# Altium schematic sheet oysm_Keyboard_Power_supply.SchDoc: PCA20020 - Power Supply
size A4; Organization: Nordic Semiconductor; DocumentNumber: 8; SheetNumber: 8; SheetTotal: 9; CompanyName: Nordic Semiconductor; DocumentSize: A4
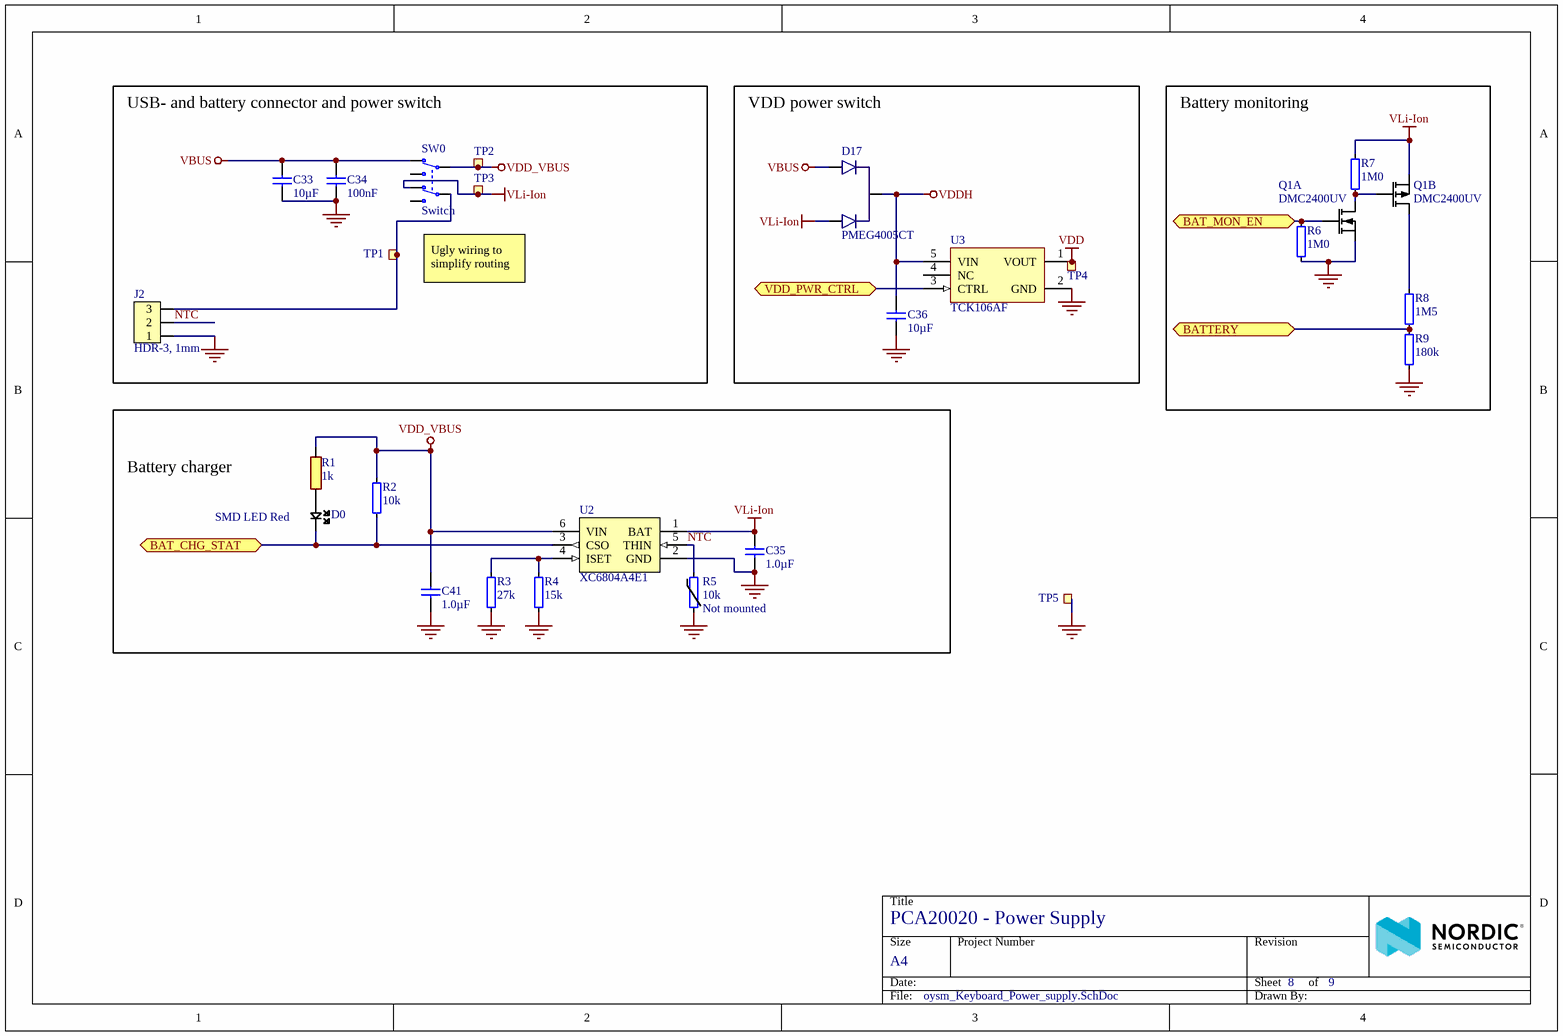
[diagram p0: oysm_Keyboard_Power_supply.SchDoc]

## Parts
C33  10µF  [CAPC1608X06L]
C34  100nF  [CAPC1005X04L]
C35  1.0µF  [CAPC1608X06L]
C36  10µF  [CAPC1608X06L]
C41  1.0µF  [CAPC1608X06L]
D0  SMD LED Red  [I_LEDC0603(1608)_N]
D17  PMEG4005CT  [SOT95P230X110-3N]
J2  HDR-3, 1mm  [SM03B-SRSS-TB]
Q1  DMC2400UV  [SOTFL50P162X60-6N]  (parts A,B of 2)
R1  1k  [RESC0603(1608)_N]
R2  10k  [RESC1005X04L]
R3  27k  [RESC1005X04L]
R4  15k  [RESC1005X04L]
R5  10k  Assembly: Not mounted  [RESC1005X04L]
R6  1M0  [RESC1005X04L]
R7  1M0  [RESC1005X04L]
R8  1M5  [RESC1005X04L]
R9  180k  [RESC1005X04L]
SW0  Switch  [Switch-Slide-RA-J-Lead-DPDT-8.5x3.5mm]
TP1  Ø1.5mm,SMD  [TP_SMD_Ø1.5mm]  (value not drawn)  (no BOM)
TP2  Ø1.5mm,SMD  [TP_SMD_Ø1.5mm]  (value not drawn)  (no BOM)
TP3  Ø1.5mm,SMD  [TP_SMD_Ø1.5mm]  (value not drawn)  (no BOM)
TP4  Ø1.5mm,SMD  [TP_SMD_Ø1.5mm]  (value not drawn)  (no BOM)
TP5  Ø1.5mm,SMD  [TP_SMD_Ø1.5mm]  (value not drawn)  (no BOM)
U2  XC6804A4E1  [USP-6EL]
U3  TCK106AF  [SOT95P280X140-5N]

## Blocks framed on the sheet
USB- and battery connector and power switch: C33 C34 J2 SW0 TP1-TP3
VDD power switch: C36 D17 TP4 U3
Battery monitoring: Q1 R6-R9
Battery charger: C35 C41 D0 R1-R5 U2

## Ports
BAT_CHG_STAT (bidir), BAT_MON_EN (bidir), BATTERY (bidir), VDD_PWR_CTRL (bidir)

## Nets
GND: C33.2 C34.2 C35.1 C36.1 C41.1 J2.1 Q1.1(S1) R3.2 R4.2 R5.2 R6.2 R9.2 TP5.1 U2.2(GND) U2.7(GND) U3.2(GND)
VBUS: C33.1 C34.1 D17.2(A) SW0.3(N.C-1)
VDD: TP4.1 U3.1(VOUT)
VDD_VBUS: C41.2 R1.2 R2.1 SW0.2(COM-1) TP2.1 U2.6(VIN)
VDDH: C36.2 D17.3(C) U3.5(VIN)
VLi-Ion: C35.2 D17.1(A) Q1.4(S2) R7.1 SW0.6(N.C-2) TP3.1 U2.1(BAT)
BAT_CHG_STAT: D0.2 R2.2 U2.3(CSO) ; port BAT_CHG_STAT
BAT_MON_EN: Q1.2(G1) R6.1 ; port BAT_MON_EN
BATTERY: R8.2 R9.1 ; port BATTERY
NTC: J2.2 R5.1 U2.5(THIN)
VDD_PWR_CTRL: U3.3(CTRL) ; port VDD_PWR_CTRL
NetD0_1: D0.1 R1.1
NetJ2_3: J2.3 SW0.5(COM-2) TP1.1
NetQ1_3: Q1.3(D2) R8.1
NetQ1_5: Q1.5(G2) Q1.6(D1) R7.2
NetR3_1: R3.1 R4.1 U2.4(ISET)

Not connected (* = marked no-connect by the designer): SW0 1(N.O-1) 4(N.O-2); U3 4(NC)

## Notes on the sheet
- Ugly wiring to simplify routing
- Title
- Size
- Date:
- A4
- Project Number
- Sheet         of
- Revision
- File:
- Drawn By:

## Library data of the parts
C33 C36 = C0603-10µ: Capacitor, X5R, ±20%; Part number IPS: 00000007785; Note: 6.3V; Artikkelnr Noca: 20039234; Part Number: C0603-10µ; Manufacturer: *; Manufacturer Part Number: *; LatestRevisionDate: 2011-01-17; Pin Count: 2; Publisher: Nordic Semiconductor; Published: 2011-01-17; Value: 10µF; Footprint Doc: 0603; ComponentLink1URL: *; ComponentLink1Description: Datasheet; ComponentLink2URL: *; ComponentLink2Description: Supplier link; HelpURL: *; Supplier 1: *; Supplier Part Number 1: *; Supplier 2: *; Supplier Part Number 2: *
C34 = C0402-100n: Capacitor, X7R, ±10%; Part number IPS: 00000005296; Note: 16V; Artikkelnr Noca: 20039200; Part Number: C0402-100n; Manufacturer: *; Manufacturer Part Number: *; LatestRevisionDate: 2009-11-23; Pin Count: 2; Publisher: Nordic Semiconductor; Published: 2009-05-08; Value: 100nF; Footprint Doc: 0402; ComponentLink1URL: *; ComponentLink1Description: Datasheet; ComponentLink2URL: *; ComponentLink2Description: Supplier link; HelpURL: *; Supplier 1: *; Supplier Part Number 1: *; Supplier 2: *; Supplier Part Number 2: *
C35 C41 = C0603-1µ0: Capacitor, X7R, ±10%; Part number IPS: 00000000616; Note: 16V; Artikkelnr Noca: 20039282; Part Number: C0603-1µ0; Manufacturer: *; Manufacturer Part Number: *; Footprint Doc: 0603; LatestRevisionDate: 2013-06-05; Pin Count: 2; Publisher: Nordic Semiconductor; Published: 2009-05-08; Value: 1.0µF; ComponentLink1URL: *; ComponentLink1Description: Datasheet; ComponentLink2URL: *; ComponentLink2Description: Supplier link; HelpURL: *; Supplier 1: *; Supplier Part Number 1: *; Supplier 2: *; Supplier Part Number 2: *
D0 = 5143: SMD; id: 5143; rad: 0; rom: OV; lager_type: Fremlager; dybde: 2; hylle: 6; antall: 50; pakke_opprettet_av: 815; leverandor_varenr: 8554641; pris: 1; produsent: Avago; leverandor: Farnell; pakketype: 0603; komponenttype: 9; pakke_opprettet: 06/07/2014 18:55:44; symbol_opprettet_av: 815; symbol_opprettet: 06/07/2014 18:59:47; navn: SMD LED Red; nokkelord: SMD
J2 = SM03B-SRSS-TB: 1.0mm pitch connector side entry SMD; Manufacturer: JST; Manufacturer Part Number: SM03B-SRSS-TB(LF)(SN); Part number IPS: 00000001785; Note: JST, Header; Artikkelnr Noca: N.A.; Part Number: SM03B-SRSS-TB; Footprint Doc: SM03B-SRSS-TB; LatestRevisionDate: 2017-10-09; Pin Count: 3; Publisher: Nordic Semiconductor; Published: 2017-10-09; Value: HDR-3, 1mm; ComponentLink1URL: *; ComponentLink1Description: Datasheet; ComponentLink2URL: *; ComponentLink2Description: Supplier link; HelpURL: http://www.jst-mfg.com/product/pdf/eng/eSH.pdf; Supplier 1: Digi-Key; Supplier Part Number 1: 455-1803-1-ND; Supplier 2: *; Supplier Part Number 2: *
Q1 = DMC2400UV: Dual N & P Ch MOFET, 1.03A/0.7A, 480mOhm, 450mW; Manufacturer: Diodes Incorporated; Part number IPS: 00000007803; Note: Dual N & P Channel Digital FET; Artikkelnr Noca: N.A.; Part Number: DMC2400UV; Manufacturer Part Number: DMC2400UV; Footprint Doc: SOT-563; LatestRevisionDate: 2016-01-18; Pin Count: 6; Publisher: Nordic Semiconductor; Published: 2016-01-18; Value: DMC2400UV; Supplier 1: Digi-Key; Supplier Part Number 1: DMC2400UV-7DICT-ND; Supplier 2: *; Supplier Part Number 2: *; ComponentLink1URL: *; ComponentLink1Description: Datasheet; ComponentLink2URL: *; ComponentLink2Description: Supplier link; HelpURL: http://www.diodes.com/_files/datasheets/DMC2400UV.pdf
R1 = 5389: 0.1W 1% Thick film resistor; id: 5389; rad: -1; rom: OV; lager_type: Fremlager; dybde: 48; hylle: 2; antall: 100; pakke_opprettet_av: 815; pris: 0; pakketype: 0603; komponenttype: 1; pakke_opprettet: 08/07/2014 21:15:30; symbol_opprettet_av: 815; symbol_opprettet: 08/07/2014 21:16:33; navn: 1k
R2 = R0402-10k: Resistor, ±1%, 0.063W; Part number IPS: 00000002093; Note: Chip Res 1%; Artikkelnr Noca: 27049097; Part Number: R0402-10k; Manufacturer: *; Manufacturer Part Number: *; LatestRevisionDate: 2009-11-23; Pin Count: 2; Publisher: Nordic Semiconductor; Published: 2009-05-08; Value: 10k; Footprint Doc: 0402; ComponentLink1URL: *; ComponentLink1Description: Datasheet; ComponentLink2URL: *; ComponentLink2Description: Supplier link; HelpURL: *; Supplier 1: Farnell; Supplier Part Number 1: 173-8864; Supplier 2: *; Supplier Part Number 2: *
R3 = R0402-27k: Resistor, ±1%, 0.063W; Part number IPS: 00000004188; Note: Chip Res 1%; Artikkelnr Noca: 27049107; Part Number: R0402-27k; Manufacturer: *; Manufacturer Part Number: *; LatestRevisionDate: 2009-11-23; Pin Count: 2; Publisher: Nordic Semiconductor; Published: 2009-05-08; Value: 27k; Footprint Doc: 0402; ComponentLink1URL: *; ComponentLink1Description: Datasheet; ComponentLink2URL: *; ComponentLink2Description: Supplier link; HelpURL: *; Supplier 1: Farnell; Supplier Part Number 1: 173-8869; Supplier 2: *; Supplier Part Number 2: *
R4 = R0402-15k: Resistor, ±1%, 0.063W; Part number IPS: 00000002098; Note: Chip Res 1%; Artikkelnr Noca: 27049101; Part Number: R0402-15k; Manufacturer: *; Manufacturer Part Number: *; LatestRevisionDate: 2009-11-23; Pin Count: 2; Publisher: Nordic Semiconductor; Published: 2009-05-08; Value: 15k; Footprint Doc: 0402; ComponentLink1URL: *; ComponentLink1Description: Datasheet; ComponentLink2URL: *; ComponentLink2Description: Supplier link; HelpURL: *; Supplier 1: Farnell; Supplier Part Number 1: 173-8866; Supplier 2: *; Supplier Part Number 2: *
R5 = NCP15XH103F03RC: THERMISTOR 10K OHM NTC 0402 SMD; Manufacturer: Murata; Part number IPS: 00000007808; Note: Chip Res 1%; Artikkelnr Noca: N.A.; Part Number: NCP15XH103F03RC; Manufacturer Part Number: NCP15XH103F03RC; LatestRevisionDate: 2015-03-25; Pin Count: 2; Publisher: Nordic Semiconductor; Published: 2015-03-25; Value: 10k; Footprint Doc: 0402; ComponentLink1URL: *; ComponentLink1Description: Datasheet; ComponentLink2URL: *; ComponentLink2Description: Supplier link; HelpURL: *; Supplier 1: Digi-Key; Supplier Part Number 1: 490-4801-1-ND; Supplier 2: Farnell; Supplier Part Number 2: 245-6121
R6 R7 = R0402-1M0: Resistor, ±1%, 0.063W; Part number IPS: 00000006807; Note: Chip Res 1%; Artikkelnr Noca: 27049145; Part Number: R0402-1M0; Manufacturer: *; Manufacturer Part Number: *; LatestRevisionDate: 2009-11-23; Pin Count: 2; Publisher: Nordic Semiconductor; Published: 2009-05-08; Value: 1M0; Footprint Doc: 0402; ComponentLink1URL: *; ComponentLink1Description: Datasheet; ComponentLink2URL: *; ComponentLink2Description: Supplier link; HelpURL: *; Supplier 1: *; Supplier Part Number 1: *; Supplier 2: *; Supplier Part Number 2: *
R8 = R0402-1M5: Resistor, ±1%, 0.063W; Part number IPS: 00000007809; Note: Chip Res 1%; Artikkelnr Noca: 27049149; Part Number: R0402-1M5; Manufacturer: *; Manufacturer Part Number: *; LatestRevisionDate: 2009-11-23; Pin Count: 2; Publisher: Nordic Semiconductor; Published: 2009-05-08; Value: 1M5; Footprint Doc: 0402; ComponentLink1URL: *; ComponentLink1Description: Datasheet; ComponentLink2URL: *; ComponentLink2Description: Supplier link; HelpURL: *; Supplier 1: *; Supplier Part Number 1: *; Supplier 2: *; Supplier Part Number 2: *
R9 = R0402-180k: Resistor, ±1%, 0.063W; Part number IPS: 00000007810; Note: Chip Res 1%; Artikkelnr Noca: 27049127; Part Number: R0402-180k; Manufacturer: *; Manufacturer Part Number: *; LatestRevisionDate: 2009-11-23; Pin Count: 2; Publisher: Nordic Semiconductor; Published: 2009-05-08; Value: 180k; Footprint Doc: 0402; ComponentLink1URL: *; ComponentLink1Description: Datasheet; ComponentLink2URL: *; ComponentLink2Description: Supplier link; HelpURL: *; Supplier 1: *; Supplier Part Number 1: *; Supplier 2: *; Supplier Part Number 2: *
SW0 = Switch-Slide-RA-J-Lead-DPDT-8.5x3.5mm_C&K: SMD slide Switch (ON-ON); Manufacturer: C&K Components; Manufacturer Part Number: JS202011JAQN; Part number IPS: 00000007811; Artikkelnr Noca: N.A.; Part Number: Switch-Slide-RA-J-Lead-DPDT-8.5x3.5mm_C&K; Footprint Doc: Switch-Slide-RA-J-Lead-DPDT-8.5x3.5mm; LatestRevisionDate: 2017-02-01; Pin Count: 6; Publisher: Nordic Semiconductor; Published: 2016-09-15; Value: Switch; Note: *; ComponentLink1URL: *; ComponentLink1Description: Datasheet; ComponentLink2URL: *; ComponentLink2Description: Supplier link; HelpURL: http://www.ck-components.com/media/1422/js.pdf; Supplier 1: Digi-Key; Supplier Part Number 1: CKN10722CT-ND; Supplier 2: Mouser; Supplier Part Number 2: 611-JS202011JAQN
TP1-TP5 = TP_SMD_Ø1.5MM: 1.0mm circular SMD testpad; Manufacturer: Nordic Semiconductor; Artikkelnr Noca: N.A.; Part Number: TP_SMD_Ø1.5MM; Manufacturer Part Number: *; Footprint Doc: TP_SMD_Ø1.5mm; LatestRevisionDate: 2016-06-02; Pin Count: 1; Publisher: Nordic Semiconductor; Published: 2016-06-02; Value: Ø1.5mm,SMD; Note: *; Part number IPS: N.A.; ComponentLink1URL: *; ComponentLink1Description: Datasheet; ComponentLink2URL: *; ComponentLink2Description: Supplier link; HelpURL: *; Supplier 1: *; Supplier Part Number 1: *; Supplier 2: *; Supplier Part Number 2: *
U2 = XC6804A4E14R-G: One Cell Li-ion/Li-polymer Linear Charger IC with Battery Temperature Detection; Manufacturer: Torex Semiconductor; Part number IPS: 00000007825; Artikkelnr Noca: N.A.; Part Number: XC6804A4E14R-G; Manufacturer Part Number: XC6804A4E14R-G; Footprint Doc: USP-6EL; LatestRevisionDate: 2016-09-29; Pin Count: 6; Publisher: Nordic Semiconductor; Published: 2016-09-29; Value: XC6804A4E1; Note: *; ComponentLink1URL: *; ComponentLink1Description: Datasheet; ComponentLink2URL: *; ComponentLink2Description: Supplier link; HelpURL: https://www.torexsemi.com/file/xc6804/XC6804.pdf; Supplier 1: Digi-Key; Supplier Part Number 1: 893-1312-1-ND; Supplier 2: Mouser; Supplier Part Number 2: 865-XC6804A4E14R-G
U3 = TCK106AF,LF: 1.0 A Load Switch IC with Slew Rate Control Driver in Small Package; Manufacturer: Toshiba; Part number IPS: 00000007823; Artikkelnr Noca: 15070086; Part Number: TCK106AF,LF; Manufacturer Part Number: TCK106AF,LF; Footprint Doc: SOT-25; LatestRevisionDate: 2016-09-29; Pin Count: 5; Publisher: Nordic Semiconductor; Published: 2016-09-29; Value: TCK106AF; Note: *; Supplier 1: Digi-Key; Supplier Part Number 1: TCK106AFLFCT-ND; Supplier 2: *; Supplier Part Number 2: *; ComponentLink1URL: *; ComponentLink1Description: Datasheet; ComponentLink2URL: *; ComponentLink2Description: Supplier link; HelpURL: https://toshiba.semicon-storage.com/info/docget.jsp?did=53240&prodName=TCK108AF
D17 = PMEG4005CT: DigiKey: 1727-5210-1-ND; Part Number: PMEG4005CT